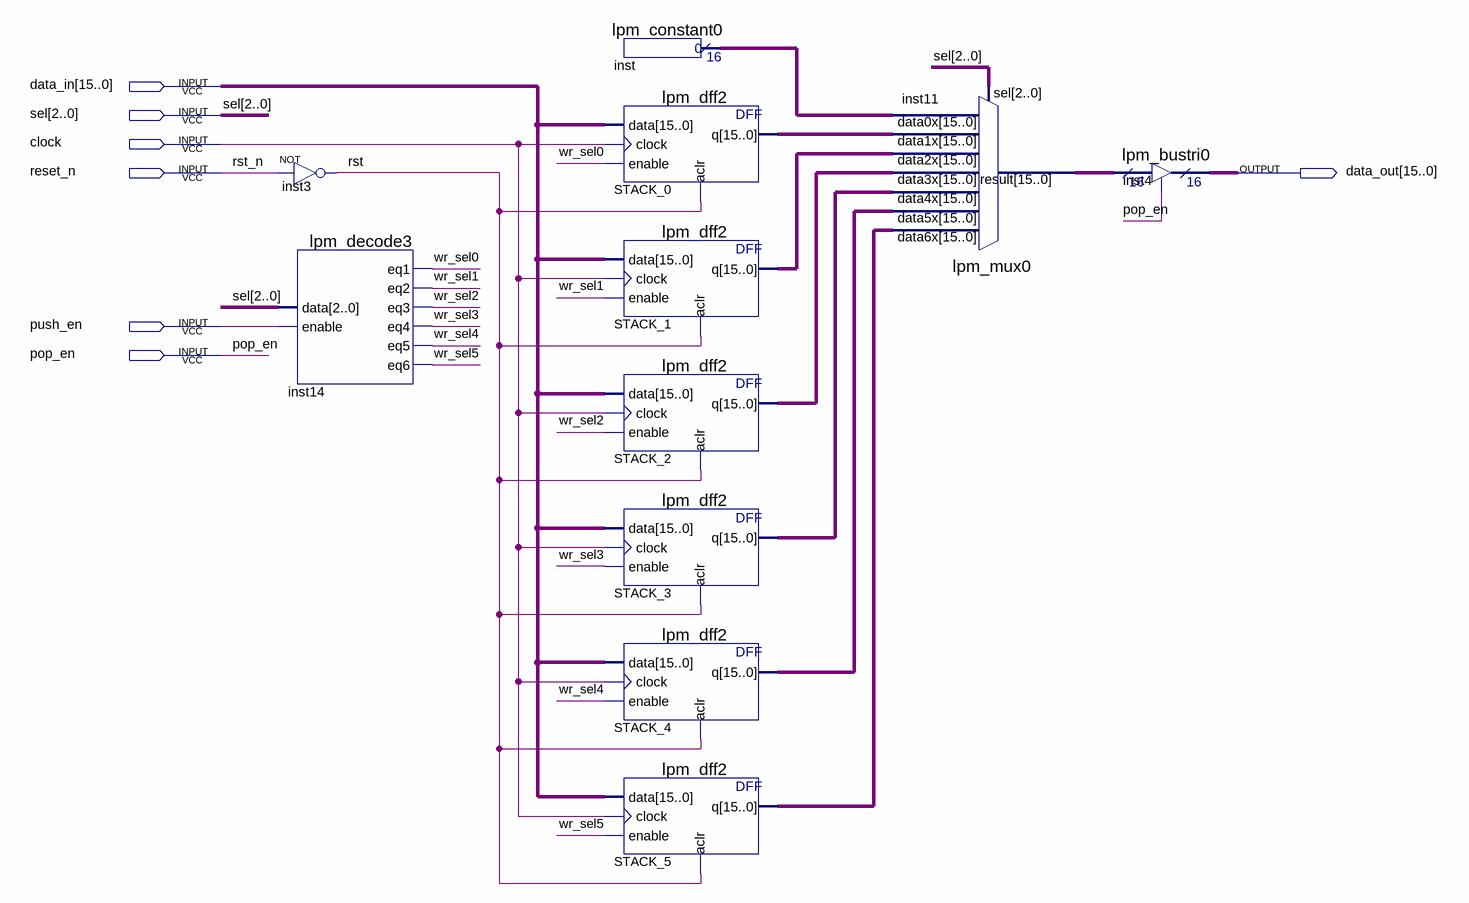
[diagram p0: schematic sheet]
// Quartus schematic stack_memory_unit.bdf as structural Verilog: 11 symbols, 7 pins
module stack_memory_unit (
  input  [15:0] data_in,
  input  [2:0] sel,
  input  clock,
  input  reset_n,
  input  push_en,
  input  pop_en,
  output [15:0] data_out
);

  wire rst, wr_sel0, wr_sel1, wr_sel2, wr_sel3, wr_sel4, wr_sel5;
  wire [15:0] inst11_result, inst_result, STACK_0_q, STACK_1_q, STACK_2_q, STACK_3_q, STACK_4_q, STACK_5_q;

  not inst3 (rst, reset_n);
  lpm_decode3 inst14 (
    .data(sel), .enable(push_en), .eq1(wr_sel0), .eq2(wr_sel1), .eq3(wr_sel2), .eq4(wr_sel3), .eq5(wr_sel4),
    .eq6(wr_sel5));
  lpm_constant0 inst (.result(inst_result));
  lpm_dff2 STACK_0 (.data(data_in), .clock(clock), .enable(wr_sel0), .aclr(rst), .q(STACK_0_q));
  lpm_dff2 STACK_1 (.data(data_in), .clock(clock), .enable(wr_sel1), .aclr(rst), .q(STACK_1_q));
  lpm_dff2 STACK_2 (.data(data_in), .clock(clock), .enable(wr_sel2), .aclr(rst), .q(STACK_2_q));
  lpm_dff2 STACK_3 (.data(data_in), .clock(clock), .enable(wr_sel3), .aclr(rst), .q(STACK_3_q));
  lpm_dff2 STACK_4 (.data(data_in), .clock(clock), .enable(wr_sel4), .aclr(rst), .q(STACK_4_q));
  lpm_dff2 STACK_5 (.data(data_in), .clock(clock), .enable(wr_sel5), .aclr(rst), .q(STACK_5_q));
  lpm_mux0 inst11 (
    .data6x(STACK_5_q), .data5x(STACK_4_q), .data4x(STACK_3_q), .data3x(STACK_2_q), .data2x(STACK_1_q),
    .data1x(STACK_0_q), .data0x(inst_result), .sel(sel), .result(inst11_result));
  lpm_bustri0 inst4 (.enabledt(pop_en), .data(inst11_result), .tridata(data_out));

  // Other names for the same wires on the sheet: rst_n = reset_n
endmodule
